# Altium project motordriver.PrjPCB
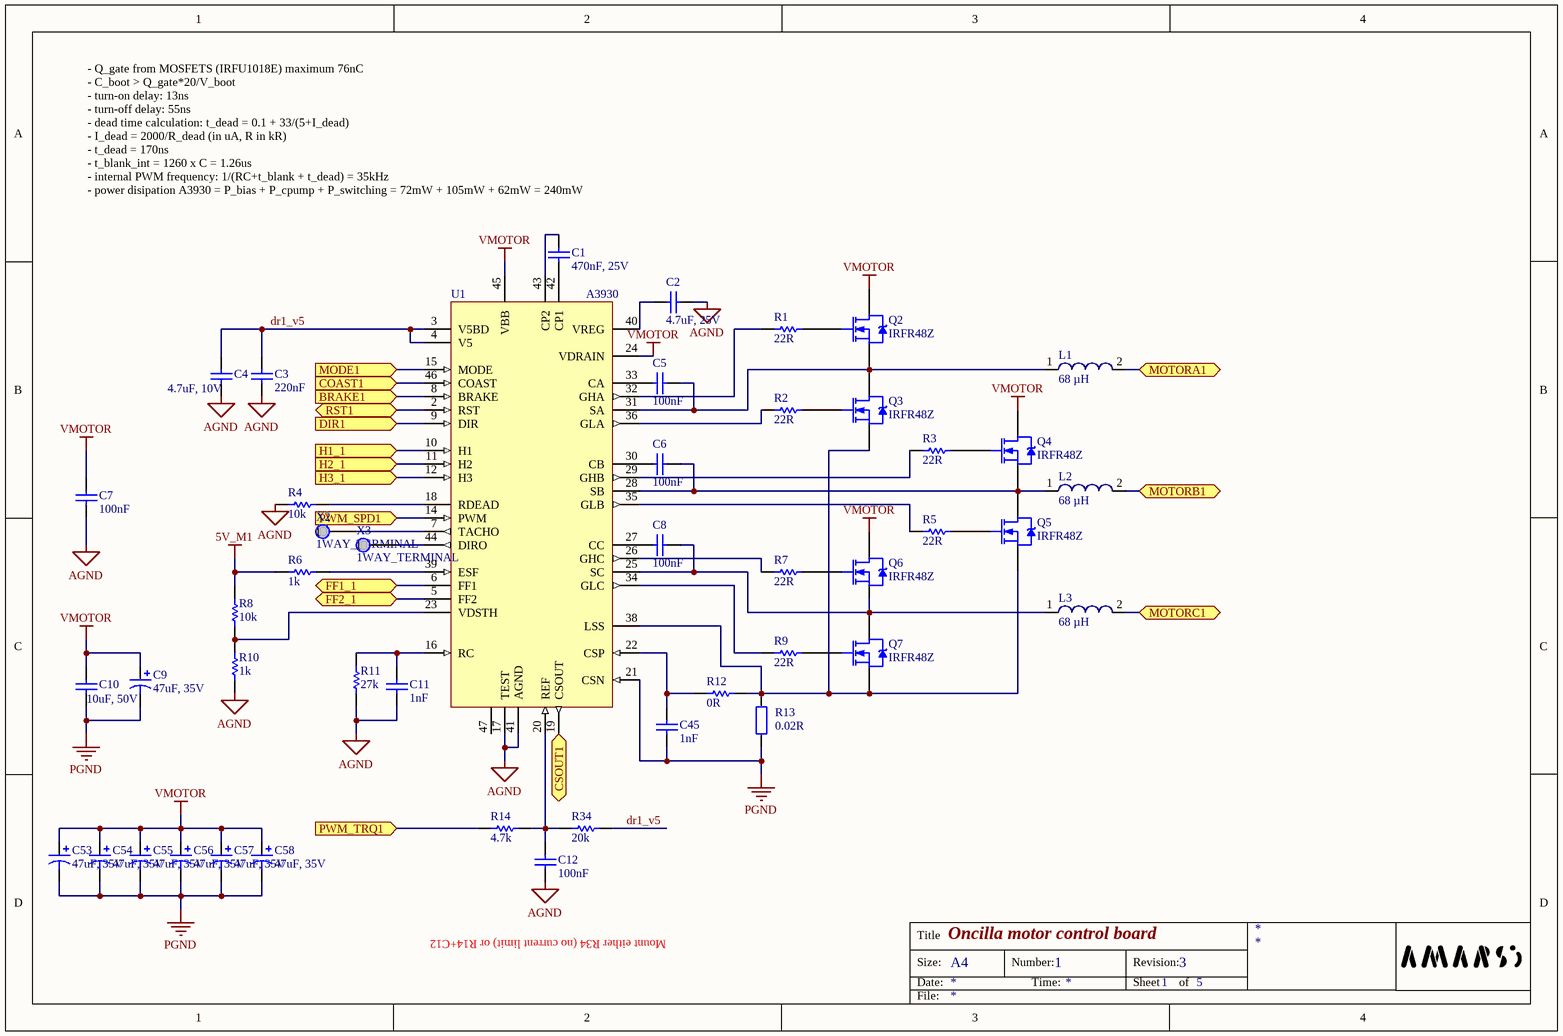
[diagram p0: driver1.SchDoc]
5 sheets, 184 parts. Net scope: flat (ports and power ports of the same name join across sheets).
Board files: motordriver_mnt.PcbDoc, motordriver.PcbDoc
Sheets:
  driver1.SchDoc
  driver2.SchDoc
  dsPIC.SchDoc
  power.SchDoc
  connectors.SchDoc

## Sheet driver1.SchDoc: Oncilla motor control board
size A4; DocumentNumber: 1; Revision: 3; SheetNumber: 1; SheetTotal: 5

### Parts
C1  470nF, 25V  [CAPC1608L]
C2  4.7uF, 25V  [CAPC2512L]
C3  value 220nF  [CAPC1608L]  (hidden comment: 100nF)
C4  4.7uF, 10V  [CAPC1608L]
C5  100nF  [CAPC1608L]
C6  100nF  [CAPC1608L]
C7  100nF  [CAPC1608L]
C8  100nF  [CAPC1608L]
C9  47uF, 35V  [7343]
C10  10uF, 50V  [CAPC3216L]
C11  1nF  [CAPC1608L]
C12  100nF  [CAPC1608L]
C45  1nF  [CAPC1608L]
C53  47uF, 35V  [7343]
C54  47uF, 35V  [7343]
C55  47uF, 35V  [7343]
C56  47uF, 35V  [7343]
C57  47uF, 35V  [7343]
C58  47uF, 35V  [7343]
L1  68 µH  [IHLP-6767GZ-11]
L2  68 µH  [IHLP-6767GZ-11]
L3  68 µH  [IHLP-6767GZ-11]
Q2  IRFR48Z  [TO-252AA_N]
Q3  IRFR48Z  [TO-252AA_N]
Q4  IRFR48Z  [TO-252AA_N]
Q5  IRFR48Z  [TO-252AA_N]
Q6  IRFR48Z  [TO-252AA_N]
Q7  IRFR48Z  [TO-252AA_N]
R1  22R  [RESC1608L]
R2  22R  [RESC1608L]
R3  22R  [RESC1608L]
R4  10k  [RESC1608L]
R5  22R  [RESC1608L]
R6  1k  [RESC1608L]
R7  22R  [RESC1608L]
R8  10k  [RESC1608L]
R9  22R  [RESC1608L]
R10  1k  [RESC1608L]
R11  27k  [RESC1608L]
R12  0R  [RESC1608L]
R13  value 0.02R  [RESC6332N]  (hidden comment: 20mR)
R14  4.7k  [RESC1608L]
R34  20k  [RESC1608L]
U1  A3930  [TSQFP50P900X900X160_HS-48N]
X2  1WAY_TERMINAL  [TESTPIN 0.5mm]
X3  1WAY_TERMINAL  [TESTPIN 0.5mm]

### Ports
BRAKE1 (in), COAST1 (in), CSOUT1, DIR1 (in), FF1_1, FF2_1, H1_1 (in), H2_1 (in), H3_1 (in), MODE1 (in), MOTORA1, MOTORB1, MOTORC1, PWM_SPD1 (in), PWM_TRQ1 (in), RST1

### Nets
5V_M1: R6.1 R8.2
AGND: C2.2 C3.1 C4.1 C7.1 C9.2 C10.1 C11.1 C12.1 C45.1 C53.2 C54.2 C55.2 C56.2 C57.2 C58.2 R4.1 R10.1 R11.1 R13.1 U1.17(TEST) U1.21(CSN) U1.41(AGND) U1.49(AGND)  [also labelled PGND]
VMOTOR: C7.2 C9.1 C10.2 C53.1 C54.1 C55.1 C56.1 C57.1 C58.1 Q2.4(D) Q4.4(D) Q6.4(D) U1.24(VDRAIN) U1.45(VBB)
A1: L1.2 ; port MOTORA1
B1: L2.2 ; port MOTORB1
C1: L3.2 ; port MOTORC1
dr1_v5: C3.2 C4.2 R34.2 U1.3(V5BD) U1.4(V5)
H1_1: U1.10(H1) ; port H1_1
H2_1: U1.11(H2) ; port H2_1
H3_1: U1.12(H3) ; port H3_1
NetC1_1: C1.1 U1.42(CP1)
NetC1_2: C1.2 U1.43(CP2)
NetC2_1: C2.1 U1.40(VREG)
NetC5_1: C5.1 U1.33(CA)
NetC5_2: C5.2 L1.1 Q2.3(S) Q3.4(D) U1.31(SA)
NetC6_1: C6.1 U1.30(CB)
NetC6_2: C6.2 L2.1 Q4.3(S) Q5.4(D) U1.28(SB)
NetC8_1: C8.1 U1.27(CC)
NetC8_2: C8.2 L3.1 Q6.3(S) Q7.4(D) U1.25(SC)
NetC11_2: C11.2 R11.2 U1.16(RC)
NetC12_2: C12.2 R14.2 R34.1 U1.20(REF)
NetC45_2: C45.2 R12.1 U1.22(CSP)
NetQ2_1: Q2.1(G) R1.2
NetQ3_1: Q3.1(G) R2.2
NetQ3_3: Q3.3(S) Q5.3(S) Q7.3(S) R12.2 R13.2 U1.38(LSS)
NetQ4_1: Q4.1(G) R3.2
NetQ5_1: Q5.1(G) R5.2
NetQ6_1: Q6.1(G) R7.2
NetQ7_1: Q7.1(G) R9.2
NetR1_1: R1.1 U1.32(GHA)
NetR2_1: R2.1 U1.36(GLA)
NetR3_1: R3.1 U1.29(GHB)
NetR4_2: R4.2 U1.18(RDEAD)
NetR5_1: R5.1 U1.35(GLB)
NetR6_2: R6.2 U1.39(ESF)
NetR7_1: R7.1 U1.26(GHC)
NetR8_1: R8.1 R10.2 U1.23(VDSTH)
NetR9_1: R9.1 U1.34(GLC)
NetR14_1: R14.1 ; port PWM_TRQ1
NetR30_2: U1.19(CSOUT) ; port CSOUT1
NetR33_2: U1.14(PWM) ; port PWM_SPD1
NetR42_2: U1.5(FF2) ; port FF2_1
NetU1_2: U1.2(RST) ; port RST1
NetU1_6: U1.6(FF1) ; port FF1_1
NetU1_7: U1.7(TACHO) X2.1
NetU1_8: U1.8(BRAKE) ; port BRAKE1
NetU1_9: U1.9(DIR) ; port DIR1
NetU1_15: U1.15(MODE) ; port MODE1
NetU1_44: U1.44(DIRO) X3.1
NetU1_46: U1.46(COAST) ; port COAST1

Not connected (* = marked no-connect by the designer): U1 47

### Notes on the sheet
- (near C1) - Q_gate from MOSFETS (IRFU1018E) maximum 76nC
  - C_boot > Q_gate*20/V_boot
  - turn-on delay: 13ns
  - turn-off delay: 55ns
  - dead time calculation: t_dead = 0.1 + 33/(5+I_dead)
  - I_dead = 2000/R_dead (in uA, R in kR)
  - t_dead = 170ns
  - t_blank_int = 1260 x C = 1.26us
  - internal PWM frequency: 1/(RC+t_blank + t_dead) = 35kHz
  - power disipation A3930 = P_bias + P_cpump + P_switching = 72mW + 105mW + 62mW = 240mW
- Mount either R34 (no current limit) or R14+C12
- Title
- Size:
- Date:
- A4
- Number:
- Time:
- Revision:
- Sheet
- of
- File:

### Library data of the parts
C1-C8 C10-C12 C45 = Cap Semi: Capacitor (Semiconductor SIM Model); Published: 8-Jun-2000; LatestRevisionDate: 29-May-2009; LatestRevisionNote: IPC-7351 Footprint Added.; PackageReference: C1206; Publisher: Altium Limited; PackageDescription: Chip Capacitor
  C1: Value: 470nF, 25V
  C2: Value: 4.7uF, 25V
  C4: Value: 4.7uF, 10V
  C5-C8 C12: Value: 100nF
  C10: Value: 10uF; Voltage: 50V
  C11 C45: Value: 1nF
C9 C53-C58 = 255D157X06R3D2T045: Note: See Data Sheet for full range of components; Published: 19-Mar-2004; DatasheetDocument: 04-Feb-2003; PackageReference: 7343; Publisher: Altium Limited; Code_JEITA: 7343; ComponentLink1Description: Manufacturer Link; ComponentLink1URL: http://www.vishay.com/; ComponentLink2Description: Datasheet; ComponentLink2URL: http://www.vishay.com/docs/40052/255d.pdf; Value: 47uF, 35V
L1-L3 = IHLP-6767GZ-11: IHLP-6767GZ-11 Low Profile, High Current Inductors
Q2-Q7 = IRFR110: HEXFET Power MOSFET; Note: Pin 2 is trimmed and is electrically connected to Drain.; Published: 8-Jun-2000; LatestRevisionDate: 20-Nov-2009; LatestRevisionNote: IPC-7351 Footprint Added.; DatasheetVersion: PD-9.524D; PackageReference: TO-252AA; Publisher: Altium Limited; PackageDescription: 3-Pin HEXFET Package 2.28 mm Pitch, 9.9 mm Lead Span; ComponentLink1Description: Manufacturer Link; ComponentLink1URL: http://www.irf.com/; ComponentLink2Description: Datasheet; ComponentLink2URL: http://www.irf.com/product-info/datasheets/data/irfr110.pdf; PackageVersion: Feb-2003; Code_JEDEC: TO-252-AA
R1-R12 R14 R34 = Res Semi: Semiconductor Resistor; Published: 8-Jun-2000; LatestRevisionDate: 17-Jul-2002; LatestRevisionNote: Re-released for DXP Platform.; PackageReference: AXIAL-0.5; Publisher: Altium Limited
  R1-R3 R5 R7 R9: Value: 22R
  R4 R8: Value: 10k
  R6 R10: Value: 1k
  R11: Value: 27k
  R12: Value: 0R
  R14: Value: 4.7k
  R34: Value: 20k
R13 = Res2: Resistor; Published: 8-Jun-2000; LatestRevisionDate: 17-Jul-2002; LatestRevisionNote: Re-released for DXP Platform.; PackageReference: AXIAL-0.4; Publisher: Altium Limited
U1 = A3930: brushless motor driver, 3-phase

## Sheet driver2.SchDoc: Oncilla motor control board
size A4; DocumentNumber: 2; Revision: 3; SheetNumber: 2; SheetTotal: 5
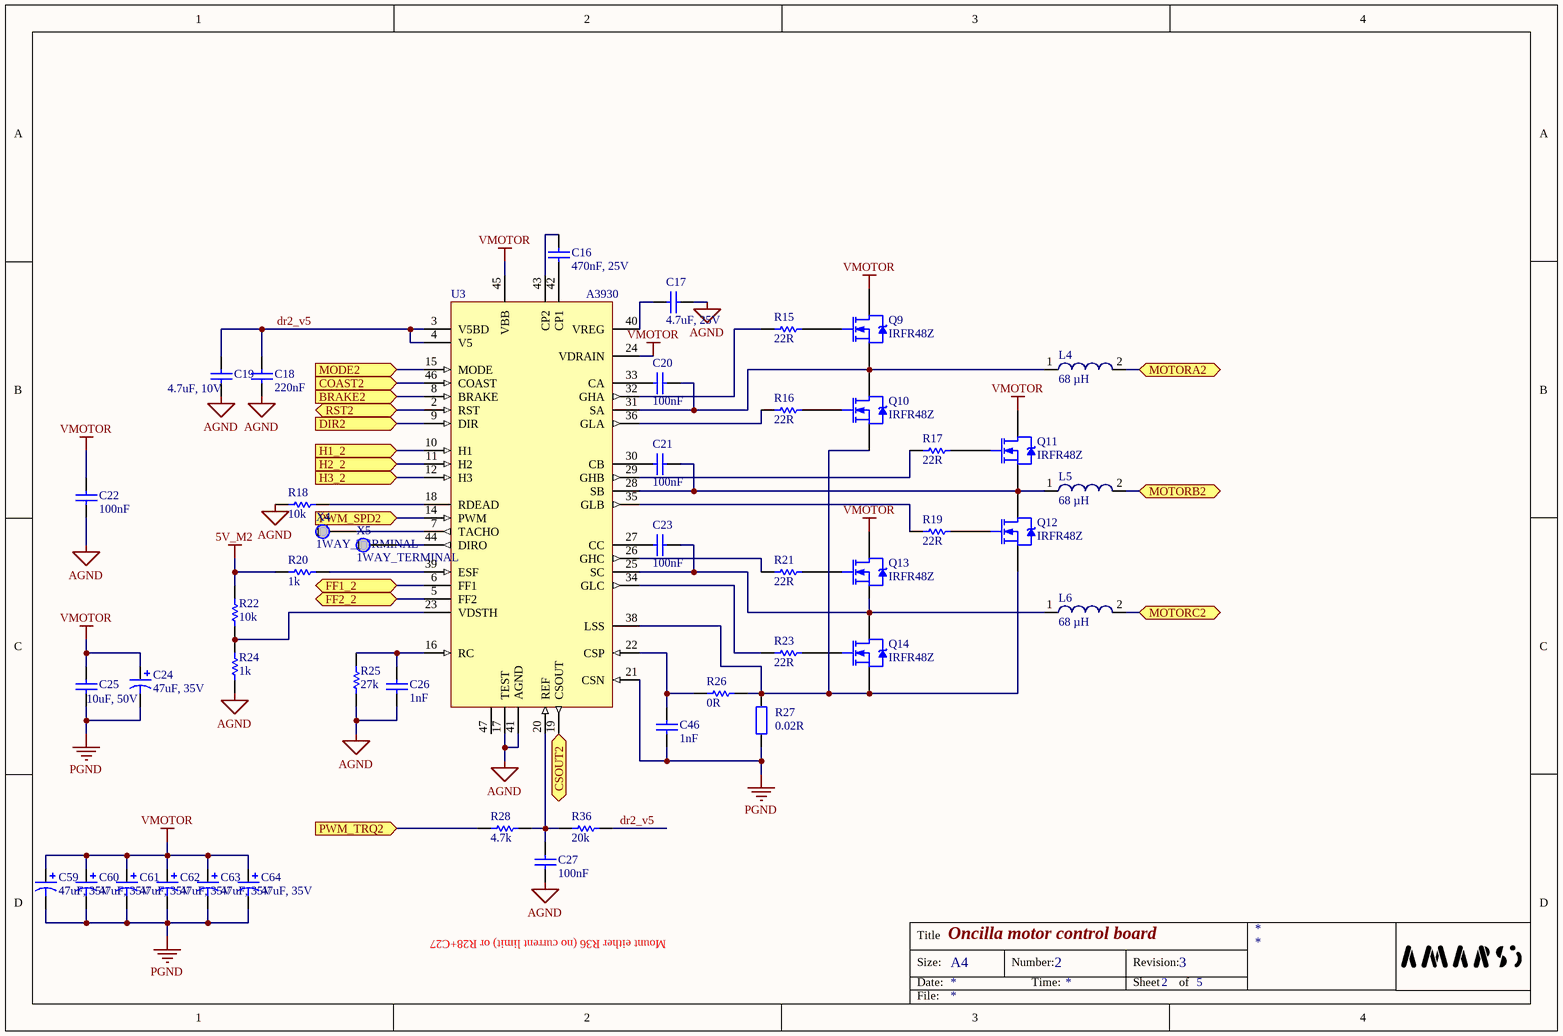
[diagram p1: driver2.SchDoc]

### Parts
C16  470nF, 25V  [CAPC1608L]
C17  4.7uF, 25V  [CAPC2512L]
C18  value 220nF  [CAPC1608L]  (hidden comment: 100nF)
C19  4.7uF, 10V  [CAPC1608L]
C20  100nF  [CAPC1608L]
C21  100nF  [CAPC1608L]
C22  100nF  [CAPC1608L]
C23  100nF  [CAPC1608L]
C24  47uF, 35V  [7343]
C25  10uF, 50V  [CAPC3216L]
C26  1nF  [CAPC1608L]
C27  100nF  [CAPC1608L]
C46  1nF  [CAPC1608L]
C59  47uF, 35V  [7343]
C60  47uF, 35V  [7343]
C61  47uF, 35V  [7343]
C62  47uF, 35V  [7343]
C63  47uF, 35V  [7343]
C64  47uF, 35V  [7343]
L4  68 µH  [IHLP-6767GZ-11]
L5  68 µH  [IHLP-6767GZ-11]
L6  68 µH  [IHLP-6767GZ-11]
Q9  IRFR48Z  [TO-252AA_N]
Q10  IRFR48Z  [TO-252AA_N]
Q11  IRFR48Z  [TO-252AA_N]
Q12  IRFR48Z  [TO-252AA_N]
Q13  IRFR48Z  [TO-252AA_N]
Q14  IRFR48Z  [TO-252AA_N]
R15  22R  [RESC1608L]
R16  22R  [RESC1608L]
R17  22R  [RESC1608L]
R18  10k  [RESC1608L]
R19  22R  [RESC1608L]
R20  1k  [RESC1608L]
R21  22R  [RESC1608L]
R22  10k  [RESC1608L]
R23  22R  [RESC1608L]
R24  1k  [RESC1608L]
R25  27k  [RESC1608L]
R26  0R  [RESC1608L]
R27  value 0.02R  [RESC6332N]  (hidden comment: 20mR)
R28  4.7k  [RESC1608L]
R36  20k  [RESC1608L]
U3  A3930  [TSQFP50P900X900X160_HS-48N]
X4  1WAY_TERMINAL  [TESTPIN 0.5mm]
X5  1WAY_TERMINAL  [TESTPIN 0.5mm]

### Ports
BRAKE2 (in), COAST2 (in), CSOUT2, DIR2 (in), FF1_2, FF2_2, H1_2 (in), H2_2 (in), H3_2 (in), MODE2 (in), MOTORA2, MOTORB2, MOTORC2, PWM_SPD2 (in), PWM_TRQ2 (in), RST2

### Nets
5V_M2: R20.1 R22.2
AGND: C17.2 C18.1 C19.1 C22.1 C24.2 C25.1 C26.1 C27.1 C46.1 C59.2 C60.2 C61.2 C62.2 C63.2 C64.2 R18.1 R24.1 R25.1 R27.1 U3.17(TEST) U3.21(CSN) U3.41(AGND) U3.49(AGND)  [also labelled PGND]
VMOTOR: C22.2 C24.1 C25.2 C59.1 C60.1 C61.1 C62.1 C63.1 C64.1 Q9.4(D) Q11.4(D) Q13.4(D) U3.24(VDRAIN) U3.45(VBB)
A2: L4.2 ; port MOTORA2
B2: L5.2 ; port MOTORB2
C2: L6.2 ; port MOTORC2
dr2_v5: C18.2 C19.2 R36.2 U3.3(V5BD) U3.4(V5)
H1_2: U3.10(H1) ; port H1_2
H2_2: U3.11(H2) ; port H2_2
H3_2: U3.12(H3) ; port H3_2
NetC16_1: C16.1 U3.42(CP1)
NetC16_2: C16.2 U3.43(CP2)
NetC17_1: C17.1 U3.40(VREG)
NetC20_1: C20.1 U3.33(CA)
NetC20_2: C20.2 L4.1 Q9.3(S) Q10.4(D) U3.31(SA)
NetC21_1: C21.1 U3.30(CB)
NetC21_2: C21.2 L5.1 Q11.3(S) Q12.4(D) U3.28(SB)
NetC23_1: C23.1 U3.27(CC)
NetC23_2: C23.2 L6.1 Q13.3(S) Q14.4(D) U3.25(SC)
NetC26_2: C26.2 R25.2 U3.16(RC)
NetC27_2: C27.2 R28.2 R36.1 U3.20(REF)
NetC46_2: C46.2 R26.1 U3.22(CSP)
NetQ9_1: Q9.1(G) R15.2
NetQ10_1: Q10.1(G) R16.2
NetQ10_3: Q10.3(S) Q12.3(S) Q14.3(S) R26.2 R27.2 U3.38(LSS)
NetQ11_1: Q11.1(G) R17.2
NetQ12_1: Q12.1(G) R19.2
NetQ13_1: Q13.1(G) R21.2
NetQ14_1: Q14.1(G) R23.2
NetR15_1: R15.1 U3.32(GHA)
NetR16_1: R16.1 U3.36(GLA)
NetR17_1: R17.1 U3.29(GHB)
NetR18_2: R18.2 U3.18(RDEAD)
NetR19_1: R19.1 U3.35(GLB)
NetR20_2: R20.2 U3.39(ESF)
NetR21_1: R21.1 U3.26(GHC)
NetR22_1: R22.1 R24.2 U3.23(VDSTH)
NetR23_1: R23.1 U3.34(GLC)
NetR28_1: R28.1 ; port PWM_TRQ2
NetR35_2: U3.14(PWM) ; port PWM_SPD2
NetR42_2: U3.5(FF2) ; port FF2_2
NetR49_2: U3.19(CSOUT) ; port CSOUT2
NetU1_2: U3.2(RST) ; port RST2
NetU3_6: U3.6(FF1) ; port FF1_2
NetU3_7: U3.7(TACHO) X4.1
NetU3_8: U3.8(BRAKE) ; port BRAKE2
NetU3_9: U3.9(DIR) ; port DIR2
NetU3_15: U3.15(MODE) ; port MODE2
NetU3_44: U3.44(DIRO) X5.1
NetU3_46: U3.46(COAST) ; port COAST2

Not connected (* = marked no-connect by the designer): U3 47

### Notes on the sheet
- Mount either R36 (no current limit) or R28+C27
- Title
- Size:
- Date:
- A4
- Number:
- Time:
- Revision:
- Sheet
- of
- File:

### Library data of the parts
C16-C23 C25-C27 C46 = Cap Semi: Capacitor (Semiconductor SIM Model); Published: 8-Jun-2000; LatestRevisionDate: 29-May-2009; LatestRevisionNote: IPC-7351 Footprint Added.; PackageReference: C1206; Publisher: Altium Limited; PackageDescription: Chip Capacitor
  C16: Value: 470nF, 25V
  C17: Value: 4.7uF, 25V
  C19: Value: 4.7uF, 10V
  C20-C23 C27: Value: 100nF
  C25: Value: 10uF; Voltage: 50V
  C26 C46: Value: 1nF
C24 C59-C64 = 255D157X06R3D2T045: as C9 on sheet driver1; Published: 19-Mar-2004; DatasheetDocument: 04-Feb-2003; PackageReference: 7343; Publisher: Altium Limited; Code_JEITA: 7343; ComponentLink1Description: Manufacturer Link; ComponentLink1URL: http://www.vishay.com/; ComponentLink2Description: Datasheet; ComponentLink2URL: http://www.vishay.com/docs/40052/255d.pdf; Value: 47uF, 35V
L4-L6 = IHLP-6767GZ-11: as L1 on sheet driver1
Q9-Q14 = IRFR110: as Q2 on sheet driver1; Published: 8-Jun-2000; LatestRevisionDate: 20-Nov-2009; LatestRevisionNote: IPC-7351 Footprint Added.; DatasheetVersion: PD-9.524D; PackageReference: TO-252AA; Publisher: Altium Limited; PackageDescription: 3-Pin HEXFET Package 2.28 mm Pitch, 9.9 mm Lead Span; ComponentLink1Description: Manufacturer Link; ComponentLink1URL: http://www.irf.com/; ComponentLink2Description: Datasheet; ComponentLink2URL: http://www.irf.com/product-info/datasheets/data/irfr110.pdf; PackageVersion: Feb-2003; Code_JEDEC: TO-252-AA
R15-R26 R28 R36 = Res Semi: Semiconductor Resistor; Published: 8-Jun-2000; LatestRevisionDate: 17-Jul-2002; LatestRevisionNote: Re-released for DXP Platform.; PackageReference: AXIAL-0.5; Publisher: Altium Limited
  R15-R17 R19 R21 R23: Value: 22R
  R18 R22: Value: 10k
  R20 R24: Value: 1k
  R25: Value: 27k
  R26: Value: 0R
  R28: Value: 4.7k
  R36: Value: 20k
R27 = Res2: Resistor; Published: 8-Jun-2000; LatestRevisionDate: 17-Jul-2002; LatestRevisionNote: Re-released for DXP Platform.; PackageReference: AXIAL-0.4; Publisher: Altium Limited
U3 = A3930: brushless motor driver, 3-phase

## Sheet dsPIC.SchDoc: Oncilla motor control board
size A4; DocumentNumber: 3; Revision: 3; SheetNumber: 3; SheetTotal: 5
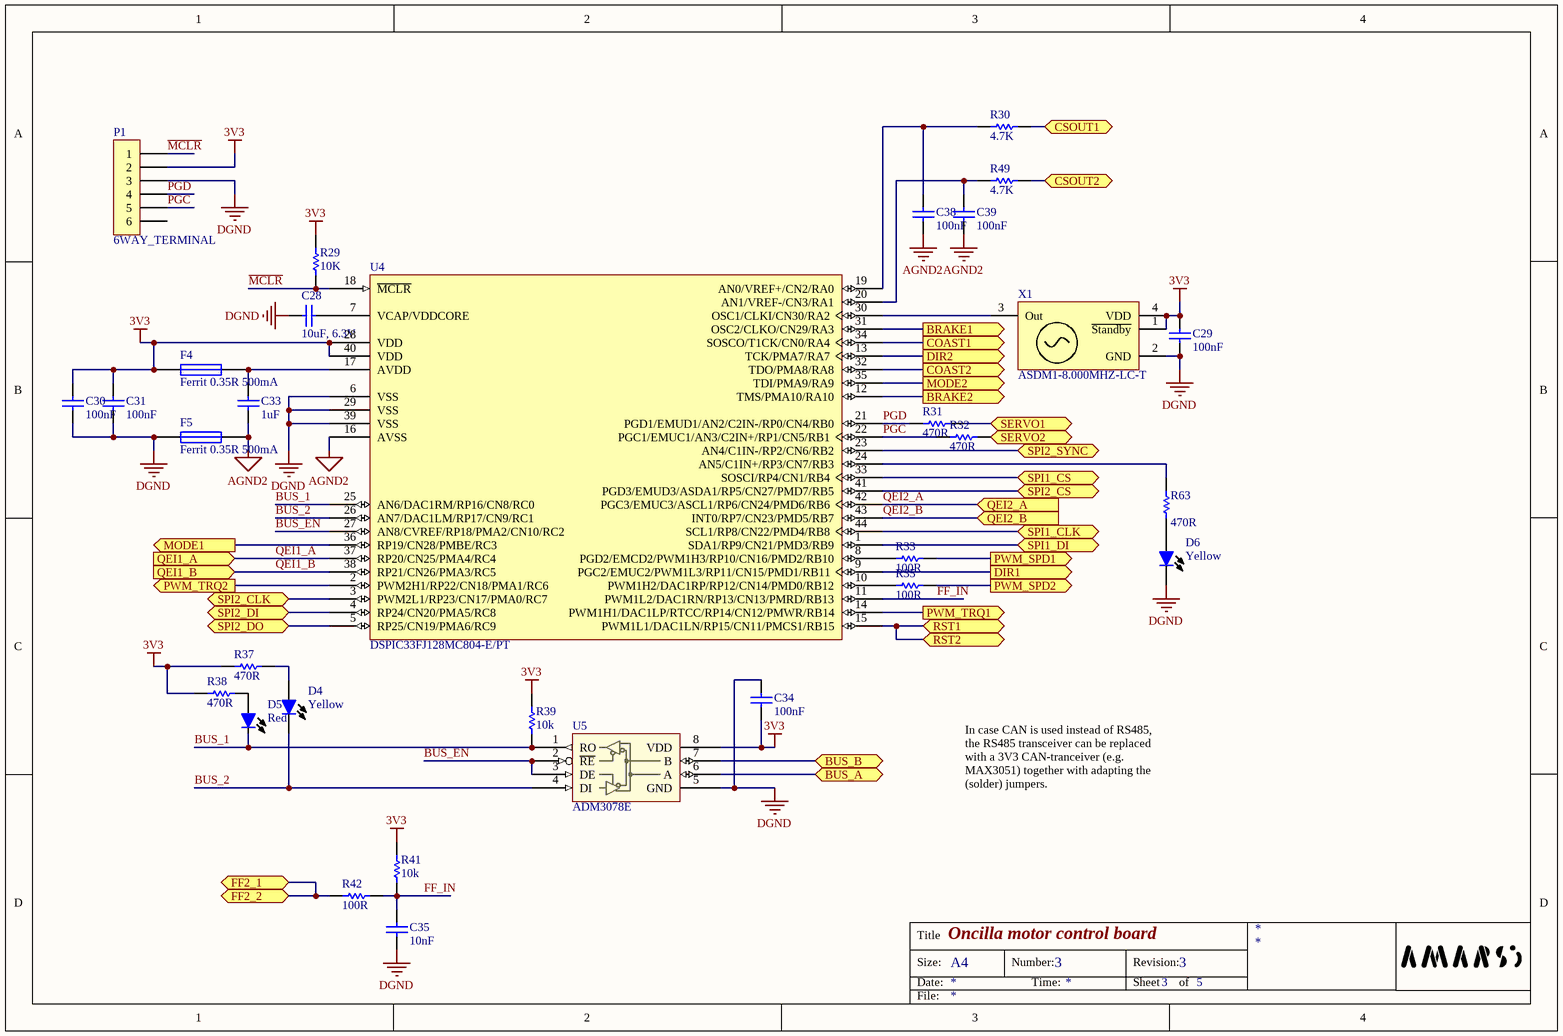
[diagram p2: dsPIC.SchDoc]

### Parts
C28  10uF, 6.3V  [CAPC1608L]
C29  100nF  [CAPC1608L]
C30  100nF  [CAPC1608L]
C31  100nF  [CAPC1608L]
C33  value 1uF  [CAPC1608L]  (hidden comment: 1uF, 25V)
C34  100nF  [CAPC1608L]
C35  10nF  [CAPC1608L]
C38  100nF  [CAPC1608L]
C39  100nF  [CAPC1608L]
D4  Color: Yellow  [CD1608-0603]  (hidden comment: LED Yellow)
D5  Color: Red  [CD1608-0603]  (hidden comment: LED Red)
D6  Color: Yellow  [CD1608-0603]  (hidden comment: LED Green)
F4  Ferrit 0.35R 500mA  [RESC1608L]
F5  Ferrit 0.35R 500mA  [RESC1608L]
P1  6WAY_TERMINAL  [MICROMATCH_6WAY_SE]
R29  10k  [RESC1608L]
R30  4.7k  [RESC1608L]
R31  470R  [RESC1608L]
R32  470R  [RESC1608L]
R33  100R  [RESC1608L]
R35  100R  [RESC1608L]
R37  470R  [RESC1608L]
R38  470R  [RESC1608L]
R39  10k  [RESC1608L]
R41  10k  [RESC1608L]
R42  100R  [RESC1608L]
R49  4.7k  [RESC1608L]
R63  470R  [RESC1608L]
U4  DSPIC33FJ128MC804-E/PT  [TQFP-PT44_N]
U5  ADM3078E  [SOIC-8_M]
X1  ASDM1-8.000MHZ-LC-T  [Crystal-Oscillator-2520]

### Ports
BRAKE1 (out), BRAKE2 (out), BUS_A, BUS_B, COAST1 (out), COAST2 (out), CSOUT1, CSOUT2, DIR1 (out), DIR2 (out), FF2_1, FF2_2, MODE1 (out), MODE2 (out), PWM_SPD1 (out), PWM_SPD2 (out), PWM_TRQ1 (out), PWM_TRQ2 (out), QEI1_A (in), QEI1_B (in), QEI2_A (in), QEI2_B (in), RST1, RST2, SERVO1 (bidir), SERVO2 (bidir), SPI1_CLK, SPI1_CS, SPI1_DI, SPI2_CLK, SPI2_CS, SPI2_DI, SPI2_DO, SPI2_SYNC

### Nets
3V3: C29.2 C30.2 C31.2 C34.1 F4.1 P1.2 R29.2 R37.1 R38.1 R39.2 R41.2 U4.28(VDD) U4.40(VDD) U5.8(VDD) X1.1(~{Standby}) X1.4(VDD)
AGND2: C33.1 C38.1 C39.1 F5.2 U4.16(AVSS)
DGND: C28.1 C29.1 C30.1 C31.1 C34.2 C35.1 D6.2(C) F5.1 P1.3 U4.6(VSS) U4.29(VSS) U4.39(VSS) U5.5(GND) X1.2(GND)
BUS_1: D5.2(C) R39.1 U4.25(AN6/DAC1RM/RP16/CN8/RC0) U5.1(RO)
BUS_2: D4.2(C) U4.26(AN7/DAC1LM/RP17/CN9/RC1) U5.4(DI)
BUS_EN: U4.27(AN8/CVREF/RP18/PMA2/CN10/RC2) U5.2(~{RE}) U5.3(DE)
FF_IN: C35.2 R41.1 R42.1 U4.11(PWM1L2/DAC1RN/RP13/CN13/PMRD/RB13)
~{MCLR}: P1.1 R29.1 U4.18(~{MCLR})
PGC: P1.5 R32.1 U4.22(PGC1/EMUC1/AN3/C2IN+/RP1/CN5/RB1)
PGD: P1.4 R31.1 U4.21(PGD1/EMUD1/AN2/C2IN-/RP0/CN4/RB0)
QEI1_A: U4.37(RP20/CN25/PMA4/RC4) ; port QEI1_A
QEI1_B: U4.38(RP21/CN26/PMA3/RC5) ; port QEI1_B
QEI2_A: U4.42(PGC3/EMUC3/ASCL1/RP6/CN24/PMD6/RB6) ; port QEI2_A
QEI2_B: U4.43(INT0/RP7/CN23/PMD5/RB7) ; port QEI2_B
NetC28_2: C28.2 U4.7(VCAP/VDDCORE)
NetC33_2: C33.2 F4.2 U4.17(AVDD)
NetC38_2: C38.2 R30.1 U4.19(AN0/VREF+/CN2/RA0)
NetC39_2: C39.2 R49.1 U4.20(AN1/VREF-/CN3/RA1)
NetD4_1: D4.1(A) R37.2
NetD5_1: D5.1(A) R38.2
NetD6_1: D6.1(A) R63.1
NetP2_2: U4.4(RP24/CN20/PMA5/RC8) ; port SPI2_DI
NetP2_3: U4.5(RP25/CN19/PMA6/RC9) ; port SPI2_DO
NetP2_4: U4.3(PWM2L1/RP23/CN17/PMA0/RC7) ; port SPI2_CLK
NetP2_5: U4.41(PGD3/EMUD3/ASDA1/RP5/CN27/PMD7/RB5) ; port SPI2_CS
NetP2_7: U4.23(AN4/C1IN-/RP2/CN6/RB2) ; port SPI2_SYNC
NetP5_2: U4.1(SDA1/RP9/CN21/PMD3/RB9) ; port SPI1_DI
NetP5_4: U4.44(SCL1/RP8/CN22/PMD4/RB8) ; port SPI1_CLK
NetP5_5: U4.33(SOSCI/RP4/CN1/RB4) ; port SPI1_CS
NetR14_1: U4.14(PWM1H1/DAC1LP/RTCC/RP14/CN12/PMWR/RB14) ; port PWM_TRQ1
NetR28_1: U4.2(PWM2H1/RP22/CN18/PMA1/RC6) ; port PWM_TRQ2
NetR30_2: R30.2 ; port CSOUT1
NetR31_2: R31.2 ; port SERVO1
NetR32_2: R32.2 ; port SERVO2
NetR33_1: R33.1 U4.8(PGD2/EMCD2/PWM1H3/RP10/CN16/PMD2/RB10)
NetR33_2: R33.2 ; port PWM_SPD1
NetR35_1: R35.1 U4.10(PWM1H2/DAC1RP/RP12/CN14/PMD0/RB12)
NetR35_2: R35.2 ; port PWM_SPD2
NetR42_2: R42.2 ; port FF2_2, port FF2_1
NetR49_2: R49.2 ; port CSOUT2
NetR63_2: R63.2 U4.24(AN5/C1IN+/RP3/CN7/RB3)
NetRS485_2: U5.6(A) ; port BUS_A
NetRS485_3: U5.7(B) ; port BUS_B
NetU1_2: U4.15(PWM1L1/DAC1LN/RP15/CN11/PMCS1/RB15) ; port RST1, port RST2
NetU1_8: U4.31(OSC2/CLKO/CN29/RA3) ; port BRAKE1
NetU1_9: U4.9(PGC2/EMUC2/PWM1L3/RP11/CN15/PMD1/RB11) ; port DIR1
NetU1_15: U4.36(RP19/CN28/PMBE/RC3) ; port MODE1
NetU1_46: U4.34(SOSCO/T1CK/CN0/RA4) ; port COAST1
NetU3_8: U4.12(TMS/PMA10/RA10) ; port BRAKE2
NetU3_9: U4.13(TCK/PMA7/RA7) ; port DIR2
NetU3_15: U4.35(TDI/PMA9/RA9) ; port MODE2
NetU3_46: U4.32(TDO/PMA8/RA8) ; port COAST2
NetU4_30: U4.30(OSC1/CLKI/CN30/RA2) X1.3(Out)

Not connected (* = marked no-connect by the designer): P1 6

### Notes on the sheet
- In case CAN is used instead of RS485, the RS485 transceiver can be replaced with a 3V3 CAN-tranceiver (e.g. MAX3051) together with adapting the (solder) jumpers.
- Title
- Size:
- Date:
- A4
- Number:
- Time:
- Revision:
- Sheet
- of
- File:

### Library data of the parts
C28-C31 C33-C35 C38 C39 = Cap Semi: Capacitor (Semiconductor SIM Model); Published: 8-Jun-2000; LatestRevisionDate: 29-May-2009; LatestRevisionNote: IPC-7351 Footprint Added.; PackageReference: C1206; Publisher: Altium Limited; PackageDescription: Chip Capacitor
  C28: Value: 10uF, 6.3V
  C29-C31 C34 C38 C39: Value: 100nF
  C35: Value: 10nF
D4-D6 = LED
F4 F5 = Fuse 1: Ferrit Bead; Published: 8-Jun-2000; LatestRevisionDate: 17-Jul-2002; LatestRevisionNote: Re-released for DXP Platform.; PackageReference: PIN-W2/E2.8; Publisher: Altium Limited
R29-R33 R35 R37-R39 R41 R42 R49 R63 = Res Semi: Semiconductor Resistor; Published: 8-Jun-2000; LatestRevisionDate: 17-Jul-2002; LatestRevisionNote: Re-released for DXP Platform.; PackageReference: AXIAL-0.5; Publisher: Altium Limited
  R29: Value: 10K
  R30 R49: Value: 4.7K
  R31 R32 R37 R38 R63: Value: 470R
  R33 R35 R42: Value: 100R
  R39 R41: Value: 10k
U4 = DSPIC33FJ128MC804-E/PT: High-Performance 16-bit Digital Signal Controller, 128 KB Flash, 16 KB RAM, 44-Pin TQFP, Extended High Temperature; FirstPublished: 29-Jan-2009; LatestRevisionDate: 02-Dec-2009; LatestRevisionNote: Updated to datasheet revision D, Nov-2009; DatasheetVersion: revD, Nov-2009; PackageVersion: revBB, Aug-2009; PackageReference: TQFP-PT44; Publisher: Altium Limited; PackageDescription: 44-Lead Plastic Thin Quad Flatpack (PT) - 10x10x1mm Body, 2.00mm [TQFP]; Supplier 1: Digi-Key; Supplier Part Number 1: DSPIC33FJ128MC804-E/PT-ND; Supplier 2: Newark; Supplier Part Number 2: 39M8144; Code_JEDEC: MS-026; ComponentLink1Description: Datasheet; ComponentLink1URL: http://ww1.microchip.com/downloads/en/DeviceDoc/70291D.pdf; ComponentLink2Description: Packaging Specification; ComponentLink2URL: http://www.microchip.com/stellent/groups/techpub_sg/documents/packagingspec/en012702.pdf; ComponentLink3Description: Microchip.com Home; ComponentLink3URL: http://www.microchip.com/
U5 = ADM3078E: Half-Duplex RS485 Transciever, 3.3V, 16Mbps
X1 = Oscillator: Name: ASDM1; Value: 8MHz

## Sheet power.SchDoc: Oncilla motor control board
size A4; DocumentNumber: 4; Revision: 3; SheetNumber: 4; SheetTotal: 5
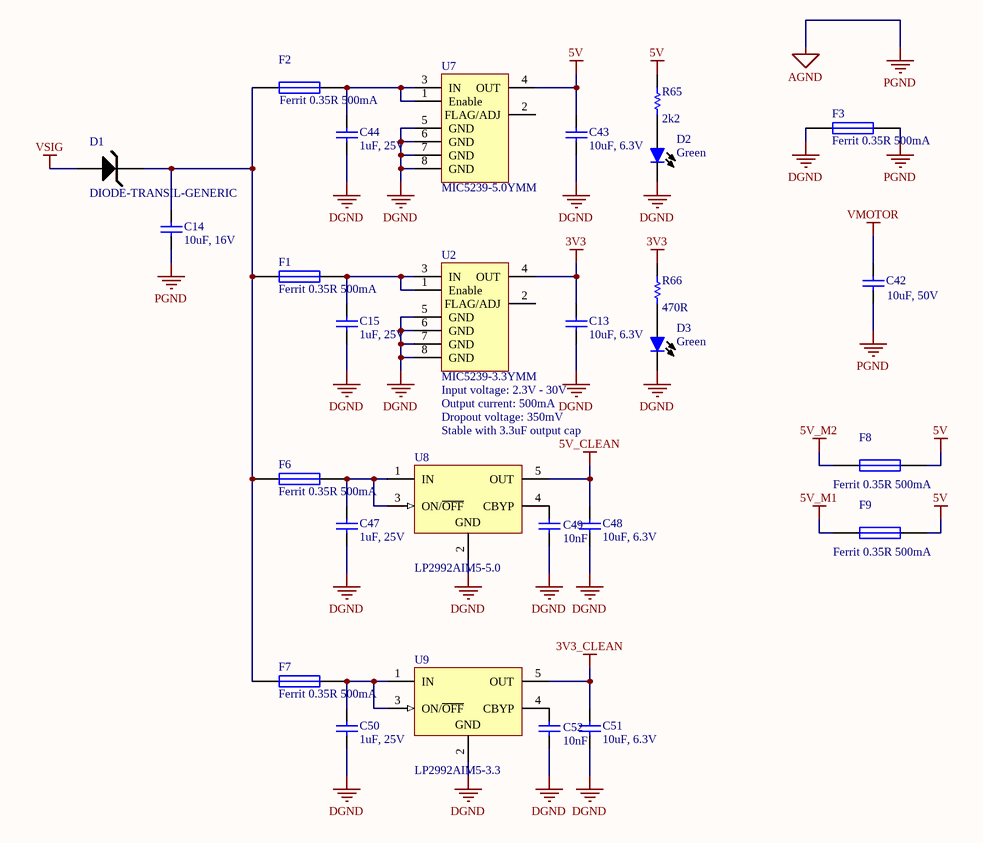
[diagram p3: power.SchDoc]

### Parts
C13  10uF, 6.3V  [CAPC1608L]
C14  10uF, 16V  [CAPC2512L]
C15  1uF, 25V  [CAPC2512L]
C42  10uF, 50V  [CAPC3216L]
C43  10uF, 6.3V  [CAPC1608L]
C44  1uF, 25V  [CAPC1608L]
C47  1uF, 25V  [CAPC1608L]
C48  10uF, 6.3V  [CAPC1608L]
C49  10nF  [CAPC1608L]
C50  1uF, 25V  [CAPC1608L]
C51  10uF, 6.3V  [CAPC1608L]
C52  10nF  [CAPC1608L]
D1  DIODE-TRANSIL-GENERIC  [DIODE-SMB]
D2  Color: Green  [CD1608-0603]  (hidden comment: LED Green)
D3  Color: Green  [CD1608-0603]  (hidden comment: LED Green)
F1  Ferrit 0.35R 500mA  [RESC1608L]
F2  Ferrit 0.35R 500mA  [RESC1608L]
F3  Ferrit 0.35R 500mA  [RESC1608L]
F6  Ferrit 0.35R 500mA  [RESC1608L]
F7  Ferrit 0.35R 500mA  [RESC1608L]
F8  Ferrit 0.35R 500mA  [RESC1608L]
F9  Ferrit 0.35R 500mA  [RESC1608L]
R65  2k2  [RESC1608L]
R66  470R  [RESC1608L]
U2  MIC5239-3.3YMM  [MSOP-8]
U7  MIC5239-5.0YMM  [MSOP-8]
U8  LP2992AIM5-5.0  [MF05A_N]
U9  LP2992AIM5-3.3  [MF05A_N]

### Nets
3V3: C13.2 R66.2 U2.4(OUT)
3V3_CLEAN: C51.2 U9.5(OUT)
5V: C43.2 F8.2 F9.2 R65.2 U7.4(OUT)
5V_CLEAN: C48.2 U8.5(OUT)
5V_M1: F9.1
5V_M2: F8.1
AGND: C14.1 C42.1 F3.2  [also labelled PGND]
DGND: C13.1 C15.1 C43.1 C44.1 C47.1 C48.1 C49.1 C50.1 C51.1 C52.1 D2.2(C) D3.2(C) F3.1 U2.5(GND) U2.6(GND) U2.7(GND) U2.8(GND) U7.5(GND) U7.6(GND) U7.7(GND) U7.8(GND) U8.2(GND) U9.2(GND)
VMOTOR: C42.2
VSIG: D1.A
NetC14_2: C14.2 D1.K F1.1 F2.1 F6.1 F7.1
NetC15_2: C15.2 F1.2 U2.1(Enable) U2.3(IN)
NetC44_2: C44.2 F2.2 U7.1(Enable) U7.3(IN)
NetC47_2: C47.2 F6.2 U8.1(IN) U8.3(ON/~{OFF})
NetC49_2: C49.2 U8.4(CBYP)
NetC50_2: C50.2 F7.2 U9.1(IN) U9.3(ON/~{OFF})
NetC52_2: C52.2 U9.4(CBYP)
NetD2_1: D2.1(A) R65.1
NetD3_1: D3.1(A) R66.1

Not connected (* = marked no-connect by the designer): U2 2(FLAG/ADJ); U7 2(FLAG/ADJ)

### Notes on the sheet
- (near U2) Input voltage: 2.3V - 30V
- Dropout voltage: 350mV
- (near U2) Output current: 500mA
- (near U8) Stable with 3.3uF output cap
- Title
- Size:
- Date:
- A4
- Number:
- Time:
- Revision:
- Sheet
- of
- File:

### Library data of the parts
C13-C15 C42-C44 C47-C52 = Cap Semi: Capacitor (Semiconductor SIM Model); Published: 8-Jun-2000; LatestRevisionDate: 29-May-2009; LatestRevisionNote: IPC-7351 Footprint Added.; PackageReference: C1206; Publisher: Altium Limited; PackageDescription: Chip Capacitor
  C13 C43 C48 C51: Value: 10uF, 6.3V
  C14: Value: 10uF, 16V
  C15 C44 C47 C50: Value: 1uF, 25V
  C42: Value: 10uF; Voltage: 50V
  C49 C52: Value: 10nF
D1 = DIODE-TRANSIL-GENERIC: GENERIC TRANSIL
D2 D3 = LED
F1-F3 F6-F9 = Fuse 1: Ferrit Bead; Published: 8-Jun-2000; LatestRevisionDate: 17-Jul-2002; LatestRevisionNote: Re-released for DXP Platform.; PackageReference: PIN-W2/E2.8; Publisher: Altium Limited
R65 R66 = Res Semi: Semiconductor Resistor; Published: 8-Jun-2000; LatestRevisionDate: 17-Jul-2002; LatestRevisionNote: Re-released for DXP Platform.; PackageReference: AXIAL-0.5; Publisher: Altium Limited
  R65: Value: 2k2
  R66: Value: 470R
U2 U7 = MIC5239: LDO, 500mA, Vin:2.3V-30V
U8 U9 = LP2992AIM5-5.0: Micropower 250 mA Low-Noise Ultra Low-Dropout Regulator in SOT-23 and LLP Packages; Manufacturer: National Semiconductor; CompType: LDO IC; PackageTopMarking: LFFA*XTT; PowerWise: N; Published: 4-Dec-2008; DatasheetVersion: May-2005; PackageVersion: revD, Aug-2008; PackageReference: MF05A; Publisher: Altium Limited; PackageDescription: Molded SOT-23, .115 x .063 x .040 in Body, 5 Lead, .0375 in Pitch; PartNumber: LP2992AIM5-5.0; RoHS: O; PinCount: 5; DigiKeyPartNumber: LP2992AIM5-5.0CT-ND; ComponentLink1Description: LP2992 Datasheet; ComponentLink1URL: http://www.national.com/ds/LP/LP2992.pdf; ComponentLink2Description: LP2992 Web Page; ComponentLink2URL: http://www.national.com/pf/LP/LP2992.html; ComponentLink3Description: MF05A Package Page; ComponentLink3URL: http://www.national.com/packaging/folders/mf05a.html

## Sheet connectors.SchDoc: Oncilla motor control board
size A4; DocumentNumber: 5; Revision: 3; SheetNumber: 5; SheetTotal: 5
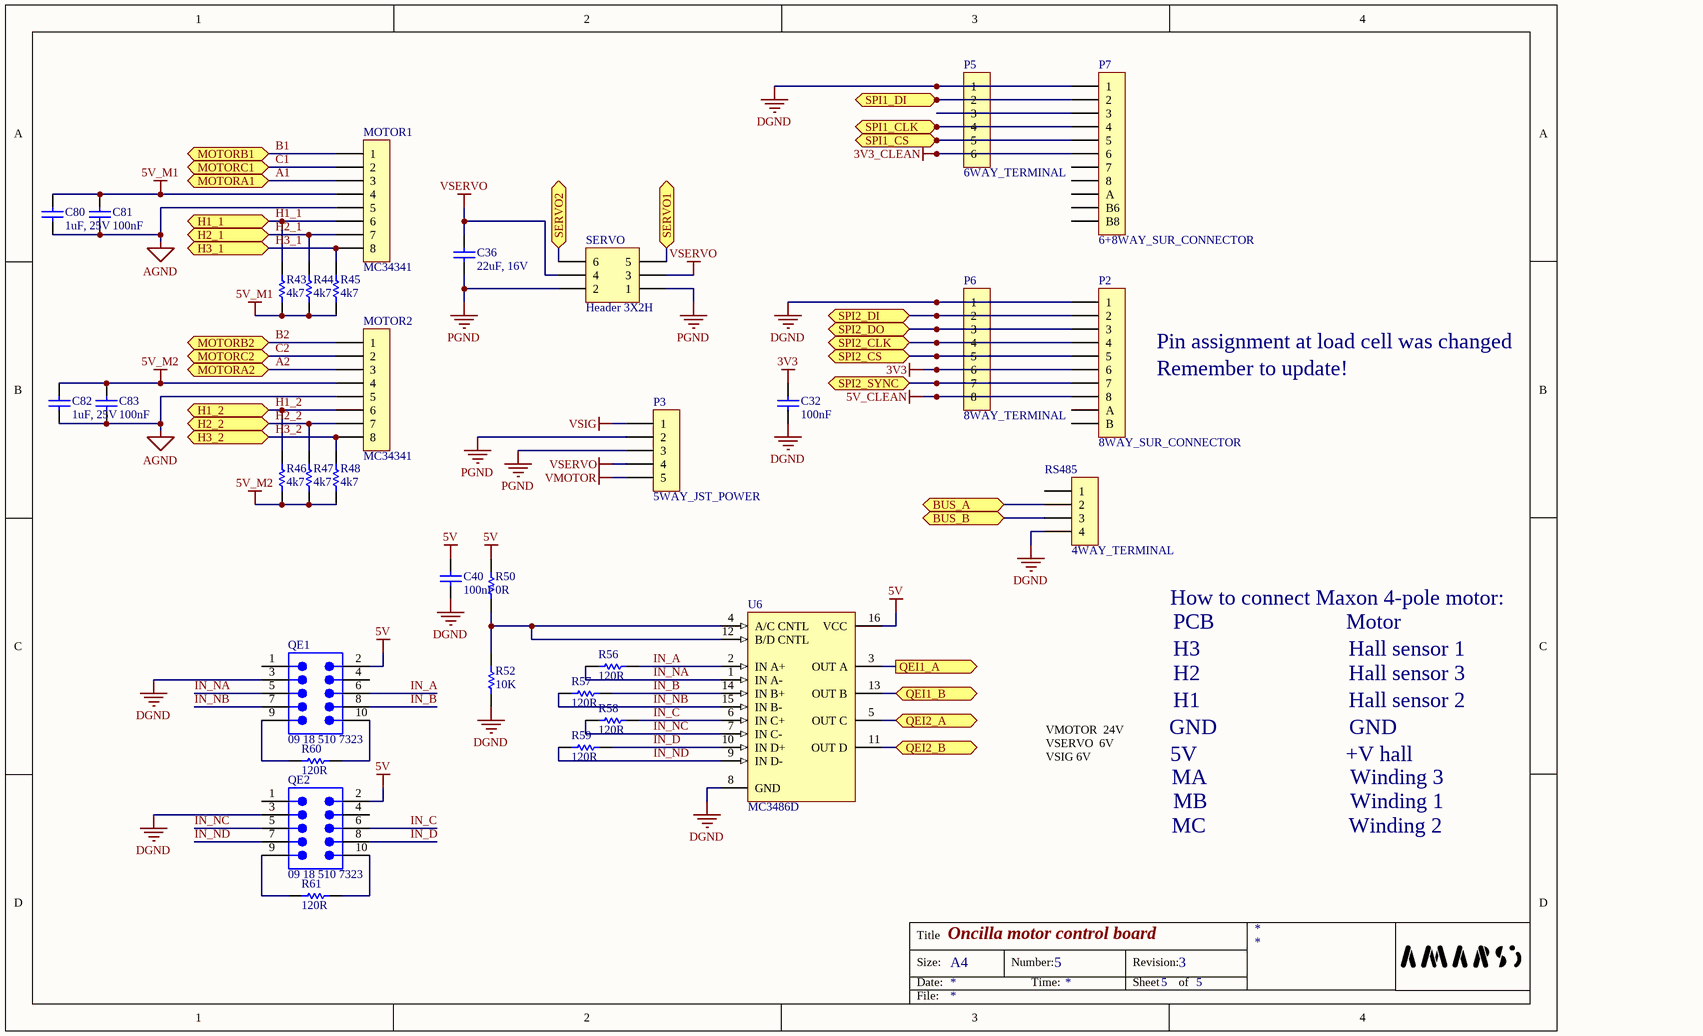
[diagram p4: connectors.SchDoc]

### Parts
C32  100nF  [CAPC1608L]
C36  22uF, 16V  [CAPC3216L]
C40  100nF  [CAPC1608L]
C80  1uF, 25V  [CAPC1608L]
C81  100nF  [CAPC1608L]
C82  1uF, 25V  [CAPC1608L]
C83  100nF  [CAPC1608L]
MOTOR1  MC34341  [MC34341]
MOTOR2  MC34341  [MC34341]
P2  8WAY_SUR_CONNECTOR  [CONNECTOR_8WAY_0.8mm]
P3  5WAY_JST_POWER  [TERMINAL_5WAY_35]
P5  6WAY_TERMINAL  [CONNECTOR_6WAY_RA_1.5MM]
P6  8WAY_TERMINAL  [CONNECTOR_8WAY_RA_1.5MM]
P7  6+8WAY_SUR_CONNECTOR  [CONNECTOR_6+8WAY_0.8mm]
QE1  09 18 510 7323  [918510x323]
QE2  09 18 510 7323  [918510x323]
R43  value 4k7  [RESC1608L]  (hidden comment: 4.7k)
R44  value 4k7  [RESC1608L]  (hidden comment: 4.7k)
R45  value 4k7  [RESC1608L]  (hidden comment: 4.7k)
R46  value 4k7  [RESC1608L]  (hidden comment: 4.7k)
R47  value 4k7  [RESC1608L]  (hidden comment: 4.7k)
R48  value 4k7  [RESC1608L]  (hidden comment: 4.7k)
R50  0R  [RESC1608L]
R52  10k  [RESC1608L]
R56  120R  [RESC1608L]
R57  120R  [RESC1608L]
R58  120R  [RESC1608L]
R59  120R  [RESC1608L]
R60  120R  [RESC1608L]
R61  120R  [RESC1608L]
RS485  4WAY_TERMINAL  [MICROMATCH_4WAY_SE]
SERVO  Header 3X2H  [HDR2X3H]
U6  MC3486D  [751B-03_N]

### Ports
BUS_A, BUS_B, H1_1, H1_2, H2_1, H2_2, H3_1, H3_2, MOTORA1, MOTORA2, MOTORB1, MOTORB2, MOTORC1, MOTORC2, QEI1_A (out), QEI1_B, QEI2_A, QEI2_B, SERVO1 (bidir), SERVO2 (bidir), SPI1_CLK, SPI1_CS, SPI1_DI, SPI2_CLK, SPI2_CS, SPI2_DI, SPI2_DO, SPI2_SYNC

### Nets
3V3: C32.2 P2.6 P6.6
3V3_CLEAN: P5.6 P7.6
5V: C40.2 QE1.2 QE2.2 R50.2 U6.16(VCC)
5V_CLEAN: P2.8 P6.8
5V_M1: C80.2 C81.2 MOTOR1.4 R43.1 R44.1 R45.1
5V_M2: C82.2 C83.2 MOTOR2.4 R46.1 R47.1 R48.1
AGND: C36.1 C80.1 C81.1 C82.1 C83.1 MOTOR1.5 MOTOR2.5 P3.2 P3.3 SERVO.1 SERVO.2  [also labelled PGND]
DGND: C32.1 C40.1 P2.1 P5.1 P6.1 P7.1 QE1.3 QE2.3 R52.1 RS485.4 U6.8(GND)
VMOTOR: P3.5
VSERVO: C36.2 P3.4 SERVO.3 SERVO.4
VSIG: P3.1
A1: MOTOR1.3 ; port MOTORA1
A2: MOTOR2.3 ; port MOTORA2
B1: MOTOR1.1 ; port MOTORB1
B2: MOTOR2.1 ; port MOTORB2
C1: MOTOR1.2 ; port MOTORC1
C2: MOTOR2.2 ; port MOTORC2
H1_1: MOTOR1.6 R43.2 ; port H1_1
H1_2: MOTOR2.6 R46.2 ; port H1_2
H2_1: MOTOR1.7 R44.2 ; port H2_1
H2_2: MOTOR2.7 R47.2 ; port H2_2
H3_1: MOTOR1.8 R45.2 ; port H3_1
H3_2: MOTOR2.8 R48.2 ; port H3_2
IN_A: QE1.6 R56.1 U6.2(IN_A+)
IN_B: QE1.8 R57.1 U6.14(IN_B+)
IN_C: QE2.6 R58.1 U6.6(IN_C+)
IN_D: QE2.8 R59.1 U6.10(IN_D+)
IN_NA: QE1.5 R56.2 U6.1(IN_A-)
IN_NB: QE1.7 R57.2 U6.15(IN_B-)
IN_NC: QE2.5 R58.2 U6.7(IN_C-)
IN_ND: QE2.7 R59.2 U6.9(IN_D-)
QEI1_A: U6.3(OUT_A) ; port QEI1_A
QEI1_B: U6.13(OUT_B) ; port QEI1_B
QEI2_A: U6.5(OUT_C) ; port QEI2_A
QEI2_B: U6.11(OUT_D) ; port QEI2_B
NetP2_2: P2.2 P6.2 ; port SPI2_DI
NetP2_3: P2.3 P6.3 ; port SPI2_DO
NetP2_4: P2.4 P6.4 ; port SPI2_CLK
NetP2_5: P2.5 P6.5 ; port SPI2_CS
NetP2_7: P2.7 P6.7 ; port SPI2_SYNC
NetP5_2: P5.2 P7.2 ; port SPI1_DI
NetP5_3: P5.3 P7.3
NetP5_4: P5.4 P7.4 ; port SPI1_CLK
NetP5_5: P5.5 P7.5 ; port SPI1_CS
NetQE1_9: QE1.9 R60.2
NetQE1_10: QE1.10 R60.1
NetQE2_9: QE2.9 R61.2
NetQE2_10: QE2.10 R61.1
NetR31_2: SERVO.5 ; port SERVO1
NetR32_2: SERVO.6 ; port SERVO2
NetR50_1: R50.1 R52.2 U6.4(A/C_CNTL) U6.12(B/D_CNTL)
NetRS485_2: RS485.2 ; port BUS_A
NetRS485_3: RS485.3 ; port BUS_B

Not connected (* = marked no-connect by the designer): P2 A B; P7 7 8 A B6 B8; QE1 1 4; QE2 1 4; RS485 1

### Notes on the sheet
- Pin assignment at load cell was changed
- Remember to update!
- How to connect Maxon 4-pole motor:
- PCB                        Motor
- H3                           Hall sensor 1
- H2                           Hall sensor 3
- H1                           Hall sensor 2
- VMOTOR  24V
  VSERVO  6V
  VSIG 6V
- GND                        GND
- 5V                           +V hall
- MA                          Winding 3
- MC                          Winding 2
- MB                          Winding 1
- Title
- Size:
- Date:
- A4
- Number:
- Time:
- Revision:
- Sheet
- of
- File:

### Library data of the parts
C32 C36 C40 C80-C83 = Cap Semi: Capacitor (Semiconductor SIM Model); Published: 8-Jun-2000; LatestRevisionDate: 29-May-2009; LatestRevisionNote: IPC-7351 Footprint Added.; PackageReference: C1206; Publisher: Altium Limited; PackageDescription: Chip Capacitor
  C32 C40 C81 C83: Value: 100nF
  C36: Value: 22uF, 16V
  C80 C82: Value: 1uF
MOTOR1 MOTOR2 = MC34341: MC34341 - STECKER,90°,8KONT
QE1 QE2 = 09 18 510 7323: Flat Cable Connector (IDC), Low-Profile Male Header, Angled Solder Pin, 10 Contacts, Performance Level 3; PCB_Layout: Complies with manufacturer's recommendation.; DrillSize: Corresponds to nominal value.; Published: 15-Nov-2004; DatasheetDocument: Sep-2003; PackageDocument: 03-Jun-2003; PackageReference: 918510x323; Publisher: Altium Limited; ComponentLink1Description: Manufacturer Link; ComponentLink1URL: http://www.harting.com/; ComponentLink2Description: Selection Guide; ComponentLink2URL: http://www.harting.com/imperia/md/content/steckverbinderundsystemkomponenten/folder/interface_engl_chapter_09.pdf
R43-R48 R50 R52 R56-R61 = Res Semi: Semiconductor Resistor; Published: 8-Jun-2000; LatestRevisionDate: 17-Jul-2002; LatestRevisionNote: Re-released for DXP Platform.; PackageReference: AXIAL-0.5; Publisher: Altium Limited
  R50: Value: 0R
  R52: Value: 10K
  R56-R61: Value: 120R
SERVO = Header 3X2H: Header, 3-Pin, Dual row, Right Angle; LatestRevisionDate: 17-Jul-2002; LatestRevisionNote: Re-released for DXP Platform.; Publisher: Altium Limited
U6 = MC3486D: Quad EIA-422/423 Line Receiver; Published: 17-Jul-2002; LatestRevisionDate: 13-Apr-2006; LatestRevisionNote: IPC-7351 Footprint Added.; DatasheetVersion: 1988; PackageVersion: 1991; PackageReference: 751B-03; Publisher: Altium Limited; PackageDescription: 16-Pin Small Outline Integrated Circuit 1.27 mm Pitch; Code_JEDEC: MS-012-AC; Code_IPC: SOIC127P600-16; ComponentLink1Description: Manufacturer Link; ComponentLink1URL: http://www.onsemi.com/site/products/parametrics/0,4446,178,00.html

## Nets that join several sheets
3V3: dsPIC (16 pins), power (C13.2 R66.2 U2.4), connectors (C32.2 P2.6 P6.6)
3V3_CLEAN: power (C51.2 U9.5), connectors (P5.6 P7.6)
5V: power (5 pins), connectors (5 pins)
5V_CLEAN: power (C48.2 U8.5), connectors (P2.8 P6.8)
5V_M1: driver1 (R6.1 R8.2), power (F9.1), connectors (6 pins)
5V_M2: driver2 (R20.1 R22.2), power (F8.1), connectors (6 pins)
AGND: driver1 (23 pins), driver2 (23 pins), power (C14.1 C42.1 F3.2), connectors (11 pins)
DGND: dsPIC (14 pins), power (23 pins), connectors (11 pins)
VMOTOR: driver1 (14 pins), driver2 (14 pins), power (C42.2), connectors (P3.5)
VSIG: power (D1.A), connectors (P3.1)
A1: driver1 (L1.2), connectors (MOTOR1.3)
A2: driver2 (L4.2), connectors (MOTOR2.3)
B1: driver1 (L2.2), connectors (MOTOR1.1)
B2: driver2 (L5.2), connectors (MOTOR2.1)
C1: driver1 (L3.2), connectors (MOTOR1.2)
C2: driver2 (L6.2), connectors (MOTOR2.2)
H1_1: driver1 (U1.10), connectors (MOTOR1.6 R43.2)
H1_2: driver2 (U3.10), connectors (MOTOR2.6 R46.2)
H2_1: driver1 (U1.11), connectors (MOTOR1.7 R44.2)
H2_2: driver2 (U3.11), connectors (MOTOR2.7 R47.2)
H3_1: driver1 (U1.12), connectors (MOTOR1.8 R45.2)
H3_2: driver2 (U3.12), connectors (MOTOR2.8 R48.2)
NetP2_2: dsPIC (U4.4), connectors (P2.2 P6.2)
NetP2_3: dsPIC (U4.5), connectors (P2.3 P6.3)
NetP2_4: dsPIC (U4.3), connectors (P2.4 P6.4)
NetP2_5: dsPIC (U4.41), connectors (P2.5 P6.5)
NetP2_7: dsPIC (U4.23), connectors (P2.7 P6.7)
NetP5_2: dsPIC (U4.1), connectors (P5.2 P7.2)
NetP5_4: dsPIC (U4.44), connectors (P5.4 P7.4)
NetP5_5: dsPIC (U4.33), connectors (P5.5 P7.5)
NetR14_1: driver1 (R14.1), dsPIC (U4.14)
NetR28_1: driver2 (R28.1), dsPIC (U4.2)
NetR30_2: driver1 (U1.19), dsPIC (R30.2)
NetR31_2: dsPIC (R31.2), connectors (SERVO.5)
NetR32_2: dsPIC (R32.2), connectors (SERVO.6)
NetR33_2: driver1 (U1.14), dsPIC (R33.2)
NetR35_2: driver2 (U3.14), dsPIC (R35.2)
NetR42_2: driver1 (U1.5), driver2 (U3.5), dsPIC (R42.2)
NetR49_2: driver2 (U3.19), dsPIC (R49.2)
NetRS485_2: dsPIC (U5.6), connectors (RS485.2)
NetRS485_3: dsPIC (U5.7), connectors (RS485.3)
NetU1_2: driver1 (U1.2), driver2 (U3.2), dsPIC (U4.15)
NetU1_8: driver1 (U1.8), dsPIC (U4.31)
NetU1_9: driver1 (U1.9), dsPIC (U4.9)
NetU1_15: driver1 (U1.15), dsPIC (U4.36)
NetU1_46: driver1 (U1.46), dsPIC (U4.34)
NetU3_8: driver2 (U3.8), dsPIC (U4.12)
NetU3_9: driver2 (U3.9), dsPIC (U4.13)
NetU3_15: driver2 (U3.15), dsPIC (U4.35)
NetU3_46: driver2 (U3.46), dsPIC (U4.32)
QEI1_A: dsPIC (U4.37), connectors (U6.3)
QEI1_B: dsPIC (U4.38), connectors (U6.13)
QEI2_A: dsPIC (U4.42), connectors (U6.5)
QEI2_B: dsPIC (U4.43), connectors (U6.11)